# EasyEDA schematic NCV7708 - 6 SILNKOW_2021-04-09.json
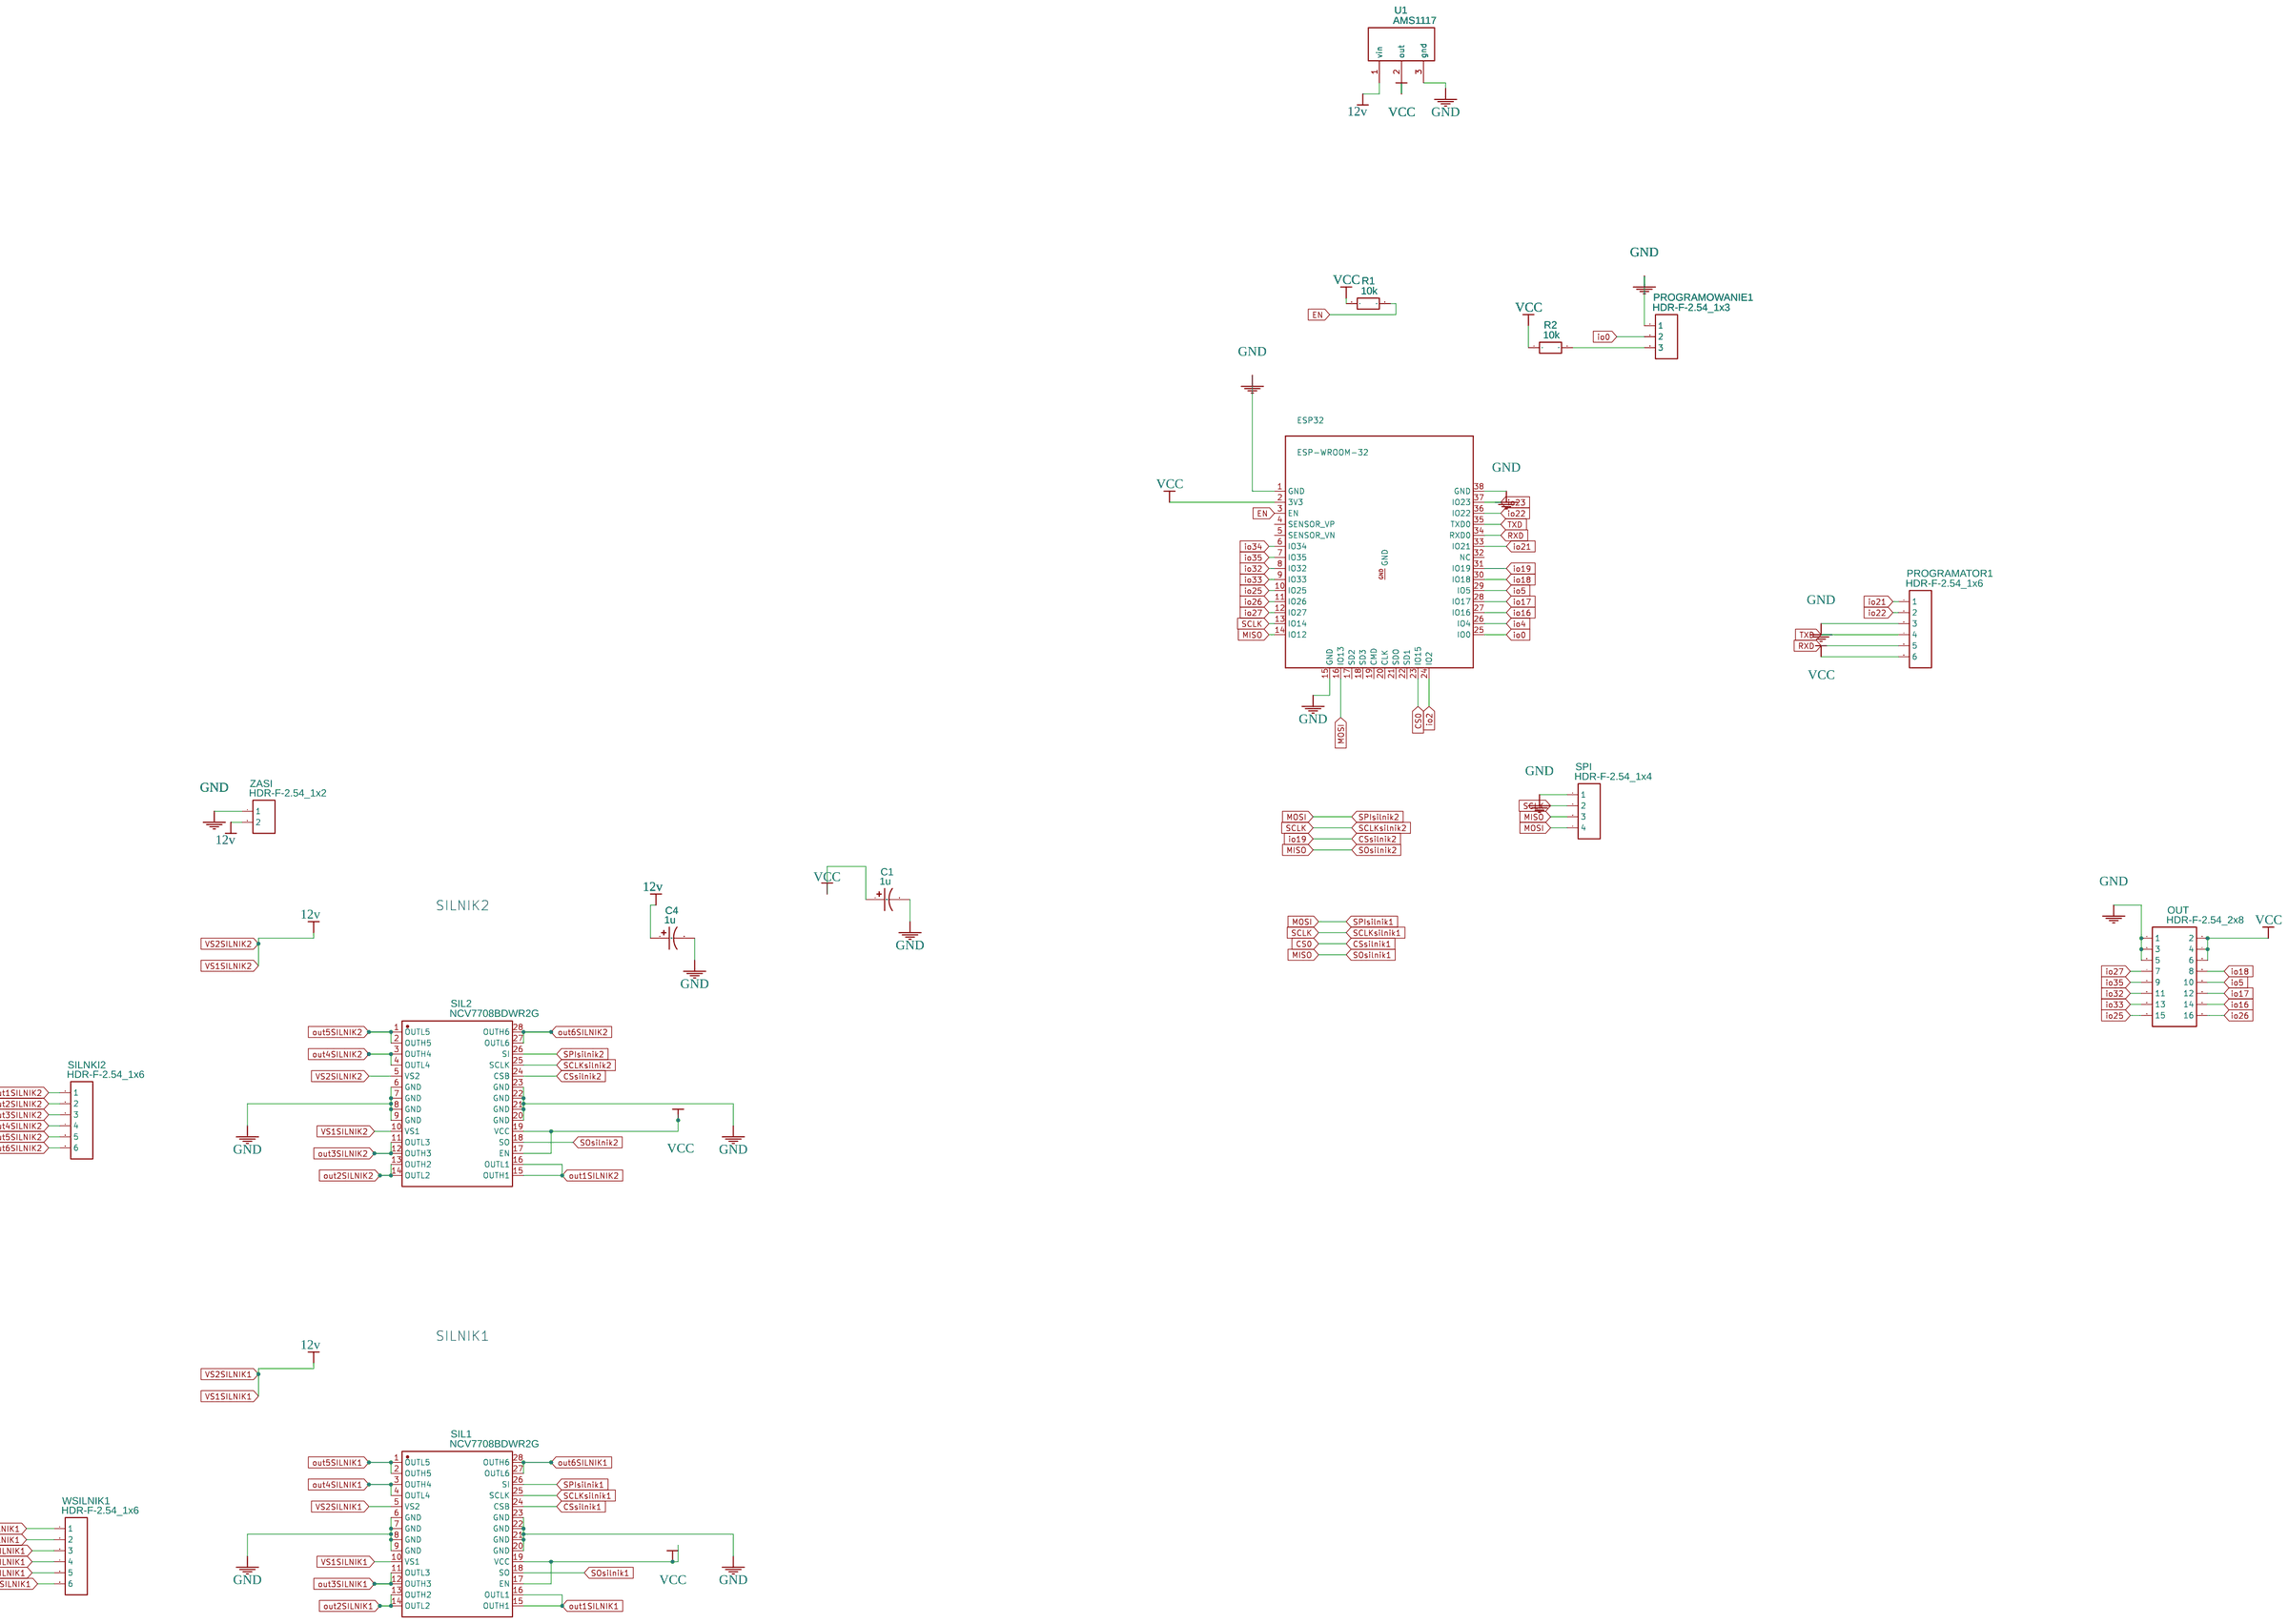
[diagram p0: schematic sheet]

## Parts
C1  1u  [CAP-D4.0×F1.5]
C4  1u  [CAP-D4.0×F1.5]
ESP32  ESP-WROOM-32  [ESP-WROOM-32]
OUT  HDR-F-2.54_2x8  [HDR-F-2.54_2X8]
PROGRAMATOR1  HDR-F-2.54_1x6  [HDR-F-2.54_1X6]
PROGRAMOWANIE1  HDR-F-2.54_1x3  [HDR-F-2.54_1X3]
R1  10k  [R0805]
R2  10k  [R0805]
SIL1  NCV7708BDWR2G  [SOIC-28_L17.9-W7.5-P1.27-LS10.3-BL]
SIL2  NCV7708BDWR2G  [SOIC-28_L17.9-W7.5-P1.27-LS10.3-BL]
SILNKI2  HDR-F-2.54_1x6  [HDR-F-2.54_1X6]
SPI  HDR-F-2.54_1x4  [HDR-F-2.54_1X4]
U1  AMS1117  [AMS1117]
WSILNIK1  HDR-F-2.54_1x6  [HDR-F-2.54_1X6]
ZASI  HDR-F-2.54_1x2  [HDR-F-2.54_1X2]

## Library data of the parts
C1 C4 = CE_TH_D4.0×F1.5_US: Contributor: LCEDA_Lib
ESP32 = -: Supplier: Element14; Supplier Part: undefined
OUT = HDR-F-2.54_2x8: Supplier Part: C30734; Supplier: LCSC; Contributor: LCEDA_Lib
PROGRAMATOR1 SILNKI2 WSILNIK1 = HDR-F-2.54_1x6: Supplier Part: C40877; Supplier: LCSC; Contributor: LCEDA_Lib
PROGRAMOWANIE1 = HDR-F-2.54_1x3: Supplier Part: C146690; Supplier: LCSC; Contributor: LCEDA_Lib
R1 R2 = R_0805_EU: Contributor: LCEDA_Lib
SIL1 SIL2 = NCV7708BDWR2G: Supplier: LCSC; Manufacturer: ON; Contributor: LCSC; Supplier Part: C70892; LCSC Assembly: Yes; SMT Type: Extend
SPI = HDR-F-2.54_1x4: Supplier Part: C225501; Supplier: LCSC; Contributor: LCEDA_Lib
U1 = AMS1117: Contributor: monstorkillbukinvv
ZASI = HDR-F-2.54_1x2: Supplier Part: C49661; Supplier: LCSC; Contributor: LCEDA_Lib

## Nets
12v: C4.1 SIL1.5(VS2) SIL1.10(VS1) SIL2.5(VS2) SIL2.10(VS1) U1.1(vin) ZASI.2
GND: C1.2 C4.2 ESP32.1(GND) ESP32.15(GND) ESP32.38(GND) OUT.1 OUT.3 OUT.5 PROGRAMATOR1.3 PROGRAMOWANIE1.1 SIL1.6(GND) SIL1.7(GND) SIL1.8(GND) SIL1.9(GND) SIL1.20(GND) SIL1.21(GND) SIL1.22(GND) SIL1.23(GND) SIL2.6(GND) SIL2.7(GND) SIL2.8(GND) SIL2.9(GND) SIL2.20(GND) SIL2.21(GND) SIL2.22(GND) SIL2.23(GND) SPI.1 U1.3(gnd) ZASI.1
VCC: C1.1 ESP32.2(3V3) OUT.2 OUT.4 OUT.6 PROGRAMATOR1.6 R1.1 R2.1 SIL1.17(EN) SIL1.19(VCC) SIL2.17(EN) SIL2.19(VCC) U1.2(out)
CS0: ESP32.23(IO15) SIL1.24(CSB)
CSsilnik2: ESP32.31(IO19) SIL2.24(CSB)
EN: ESP32.3(EN) R1.2
io0: ESP32.25(IO0) PROGRAMOWANIE1.2
io2: ESP32.24(IO2)
io4: ESP32.26(IO4)
io5: ESP32.29(IO5) OUT.10
io16: ESP32.27(IO16) OUT.14
io17: ESP32.28(IO17) OUT.12
io18: ESP32.30(IO18) OUT.8
io21: ESP32.33(IO21) PROGRAMATOR1.1
io22: ESP32.36(IO22) PROGRAMATOR1.2
io23: ESP32.37(IO23)
io25: ESP32.10(IO25) OUT.15
io26: ESP32.11(IO26) OUT.16
io27: ESP32.12(IO27) OUT.7
io32: ESP32.8(IO32) OUT.11
io33: ESP32.9(IO33) OUT.13
io34: ESP32.6(IO34)
io35: ESP32.7(IO35) OUT.9
MISO: ESP32.14(IO12) SIL1.18(SO) SIL2.18(SO) SPI.3
MOSI: ESP32.16(IO13) SIL1.26(SI) SIL2.26(SI) SPI.4
out1SILNIK1: SIL1.15(OUTH1) SIL1.16(OUTL1) WSILNIK1.1
out1SILNIK2: SIL2.15(OUTH1) SIL2.16(OUTL1) SILNKI2.1
out2SILNIK1: SIL1.13(OUTH2) SIL1.14(OUTL2) WSILNIK1.2
out2SILNIK2: SIL2.13(OUTH2) SIL2.14(OUTL2) SILNKI2.2
out3SILNIK1: SIL1.11(OUTL3) SIL1.12(OUTH3) WSILNIK1.3
out3SILNIK2: SIL2.11(OUTL3) SIL2.12(OUTH3) SILNKI2.3
out4SILNIK1: SIL1.3(OUTH4) SIL1.4(OUTL4) WSILNIK1.4
out4SILNIK2: SIL2.3(OUTH4) SIL2.4(OUTL4) SILNKI2.4
out5SILNIK1: SIL1.1(OUTL5) SIL1.2(OUTH5) WSILNIK1.5
out5SILNIK2: SIL2.1(OUTL5) SIL2.2(OUTH5) SILNKI2.5
out6SILNIK1: SIL1.27(OUTL6) SIL1.28(OUTH6) WSILNIK1.6
out6SILNIK2: SIL2.27(OUTL6) SIL2.28(OUTH6) SILNKI2.6
RXD: ESP32.34(RXD0) PROGRAMATOR1.5
SCLK: ESP32.13(IO14) SIL1.25(SCLK) SIL2.25(SCLK) SPI.2
TXD: ESP32.35(TXD0) PROGRAMATOR1.4
Net-(PROGRAMOWANIE1-3): PROGRAMOWANIE1.3 R2.2

Not connected (* = marked no-connect by the designer): ESP32 4(SENSOR_VP) 5(SENSOR_VN) 17(SD2) 18(SD3) 19(CMD) 20(CLK) 21(SDO) 22(SD1) 32(NC) GND

## Notes on the sheet
- SILNIK2
- SILNIK1
